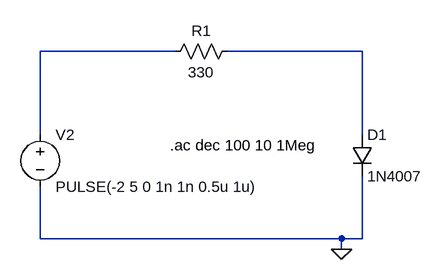
[diagram p0: schematic 1.diode.asc]
1.diode.asc, the LTspice schematic file:
Version 4
SHEET 1 880 680
WIRE 352 208 144 208
WIRE 640 208 432 208
WIRE 144 336 144 208
WIRE 640 336 640 208
WIRE 144 496 144 416
WIRE 608 496 144 496
WIRE 640 496 640 400
WIRE 640 496 608 496
WIRE 608 512 608 496
FLAG 608 512 0
SYMBOL Res 448 192 R90
WINDOW 0 0 56 VBottom 2
WINDOW 3 32 56 VTop 2
SYMATTR InstName R1
SYMATTR Value 330
SYMBOL Voltage 144 320 R0
SYMATTR InstName V2
SYMATTR Value PULSE(-2 5 0 1n 1n 0.5u 1u)
SYMBOL diode 624 336 R0
SYMATTR InstName D1
SYMATTR Value 1N4007
TEXT 344 352 Left 2 !.ac dec 100 10 1Meg

The netlist it stands for:
* 1.diode.asc
R1 N002 N001 330
V2 N001 0 PULSE(-2 5 0 1n 1n 0.5u 1u)
D1 N002 0 1N4007
.model D D
.lib standard.dio
.ac dec 100 10 1Meg
.backanno
.end